# EAGLE schematic untitled (EAGLE 8.4.0)
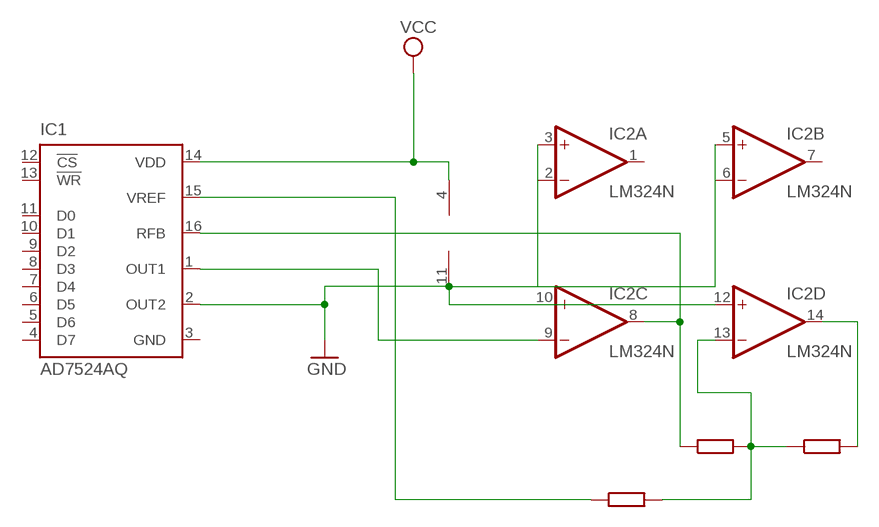
[diagram p0: schematic, sheet 1]

## Parts
IC1  AD7524AQ  [DIL16]
IC2  LM324N  [DIL14]

## Nets
GND: IC1.2(OUT2) IC2.3(A:+IN) IC2.5(B:+IN) IC2.10(C:+IN) IC2.11(P:V-) IC2.12(D:+IN)
N$1: IC1.1(OUT1) IC2.9(C:-IN)
N$2: IC1.16(RFB) IC2.8(C:OUT)
N$3: IC2.13(D:-IN)
N$4: IC1.15(VREF)
N$5: IC2.14(D:OUT)
VCC: IC1.14(VDD) IC2.4(P:V+)
Unconnected: IC1.4(D7) IC1.5(D6) IC1.6(D5) IC1.7(D4) IC1.8(D3) IC1.9(D2) IC1.10(D1) IC1.11(D0) IC1.12(!CS) IC1.13(!WR) IC2.1(A:OUT) IC2.2(A:-IN) IC2.6(B:-IN) IC2.7(B:OUT)

## Power pins joined to a net without a drawn wire
GND: IC1.3(GND)

## Library data of the parts
IC1 = analog-devices:AD7524*: 8-Bit Buffered Multiplying DAC Source: http://www.analog.com/UploadedFiles/Data_Sheets/888358036ad7524.pdf; MF: ALTERA CORPORATION; MPN: AD7524AQ; OC_FARNELL: 1464568; OC_NEWARK: 05F7379
IC2 = linear:LM324: OP AMP